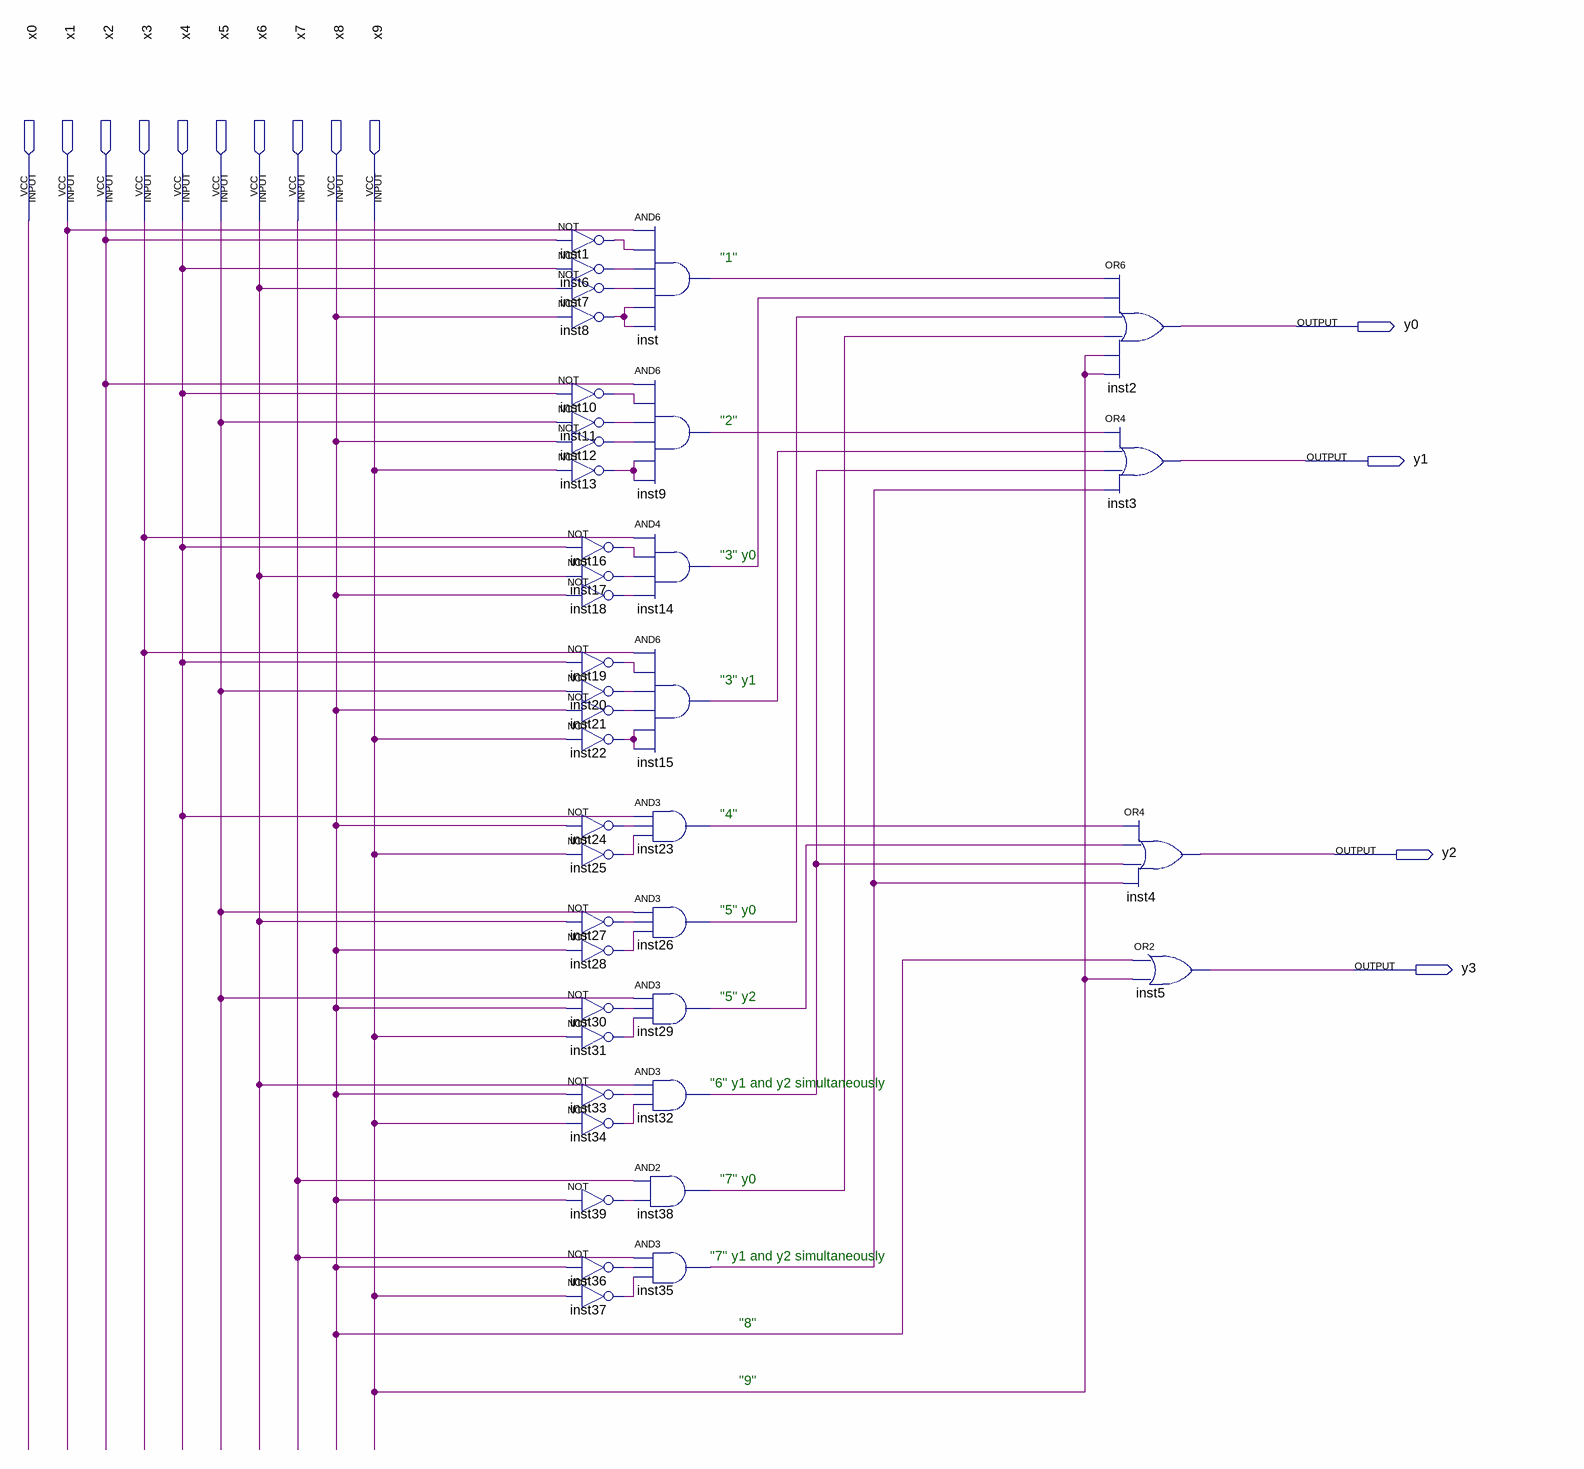
[diagram p0: schematic sheet]
// Quartus schematic priority_encoder.bdf as structural Verilog: 40 symbols, 14 pins
module priority_encoder (
  input  x0,
  input  x1,
  input  x2,
  input  x3,
  input  x4,
  input  x5,
  input  x6,
  input  x7,
  input  x8,
  input  x9,
  output y0,
  output y1,
  output y2,
  output y3
);

  wire inst1_out, inst6_out, inst7_out, inst8_out, inst9_out, inst10_out, inst11_out, inst12_out, inst13_out,
       inst14_out, inst15_out, inst16_out, inst17_out, inst18_out, inst19_out, inst20_out, inst21_out,
       inst22_out, inst23_out, inst24_out, inst25_out, inst26_out, inst27_out, inst28_out, inst29_out,
       inst30_out, inst31_out, inst32_out, inst33_out, inst34_out, inst35_out, inst36_out, inst37_out,
       inst38_out, inst39_out, inst_out;

  not inst1 (inst1_out, x2);
  not inst6 (inst6_out, x4);
  not inst7 (inst7_out, x6);
  not inst8 (inst8_out, x8);
  not inst10 (inst10_out, x4);
  not inst11 (inst11_out, x5);
  not inst12 (inst12_out, x8);
  not inst13 (inst13_out, x9);
  not inst16 (inst16_out, x4);
  not inst17 (inst17_out, x6);
  not inst18 (inst18_out, x8);
  not inst19 (inst19_out, x4);
  not inst20 (inst20_out, x5);
  not inst21 (inst21_out, x8);
  not inst22 (inst22_out, x9);
  not inst24 (inst24_out, x8);
  not inst25 (inst25_out, x9);
  not inst27 (inst27_out, x6);
  not inst28 (inst28_out, x8);
  not inst30 (inst30_out, x8);
  not inst31 (inst31_out, x9);
  not inst33 (inst33_out, x8);
  not inst34 (inst34_out, x9);
  not inst39 (inst39_out, x8);
  not inst36 (inst36_out, x8);
  not inst37 (inst37_out, x9);
  and inst (inst_out, x1, inst1_out, inst6_out, inst7_out, inst8_out, inst8_out);
  and inst9 (inst9_out, x2, inst10_out, inst11_out, inst12_out, inst13_out, inst13_out);
  and inst14 (inst14_out, x3, inst16_out, inst17_out, inst18_out);
  and inst15 (inst15_out, x3, inst19_out, inst20_out, inst21_out, inst22_out, inst22_out);
  and inst23 (inst23_out, x4, inst24_out, inst25_out);
  and inst26 (inst26_out, x5, inst27_out, inst28_out);
  and inst29 (inst29_out, x5, inst30_out, inst31_out);
  and inst32 (inst32_out, x6, inst33_out, inst34_out);
  and inst38 (inst38_out, x7, inst39_out);
  and inst35 (inst35_out, x7, inst36_out, inst37_out);
  or inst2 (y0, inst_out, inst14_out, inst26_out, inst38_out, x9, x9);
  or inst3 (y1, inst9_out, inst15_out, inst32_out, inst35_out);
  or inst4 (y2, inst23_out, inst29_out, inst32_out, inst35_out);
  or inst5 (y3, x8, x9);

  // Notes on the sheet:
  //   "1"
  //   "2"
  //   "3" y0
  //   "3" y1
  //   "4"
  //   "5" y0
  //   "5" y2
  //   "6" y1 and y2 simultaneously
  //   "7" y0
  //   "7" y1 and y2 simultaneously
  //   "8"
  //   "9"
endmodule
